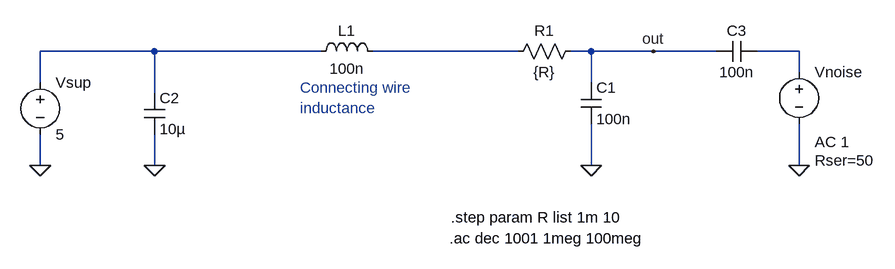
[diagram p0: schematic vsup_series_resistance.asc]
vsup_series_resistance.asc, the LTspice schematic file:
Version 4
SHEET 1 880 680
WIRE -352 96 -528 96
WIRE -96 96 -352 96
WIRE 208 96 -16 96
WIRE 320 96 288 96
WIRE 416 96 320 96
WIRE 512 96 416 96
WIRE 640 96 576 96
WIRE 640 128 640 96
WIRE -528 144 -528 96
WIRE 320 144 320 96
WIRE -352 160 -352 96
WIRE -528 272 -528 224
WIRE -352 272 -352 224
WIRE 320 272 320 208
WIRE 640 272 640 208
FLAG 640 272 0
FLAG 320 272 0
FLAG -352 272 0
FLAG -528 272 0
FLAG 416 96 out
SYMBOL voltage 640 112 R0
WINDOW 123 24 124 Left 2
WINDOW 39 24 152 Left 2
SYMATTR InstName Vnoise
SYMATTR Value ""
SYMATTR Value2 AC 1
SYMATTR SpiceLine Rser=50
SYMBOL ind -112 112 R270
WINDOW 0 32 56 VTop 2
WINDOW 3 5 56 VBottom 2
SYMATTR InstName L1
SYMATTR Value 100n
SYMBOL cap 304 144 R0
SYMATTR InstName C1
SYMATTR Value 100n
SYMBOL cap -368 160 R0
SYMATTR InstName C2
SYMATTR Value 10µ
SYMBOL voltage -528 128 R0
SYMATTR InstName Vsup
SYMATTR Value 5
SYMBOL cap 576 80 R90
WINDOW 0 0 32 VBottom 2
WINDOW 3 32 32 VTop 2
SYMATTR InstName C3
SYMATTR Value 100n
SYMBOL res 304 80 R90
WINDOW 0 0 56 VBottom 2
WINDOW 3 32 56 VTop 2
SYMATTR InstName R1
SYMATTR Value {R}
TEXT 102 384 Left 2 !.ac dec 1001 1meg 100meg
TEXT 104 352 Left 2 !.step param R list 1m 10
TEXT -128 152 Left 2 ;Connecting wire\ninductance

The netlist it stands for:
* vsup_series_resistance.asc
Vnoise N003 0 AC 1 Rser=50
L1 N001 N002 100n
C1 out 0 100n
C2 N001 0 10µ
Vsup N001 0 5
C3 N003 out 100n
R1 out N002 {R}
.ac dec 1001 1meg 100meg
.step param R list 1m 10
* Connecting wire
* inductance
.backanno
.end